# Altium schematic sheet CM4_Conn.SchDoc
size C; SheetNumber: 1; SheetTotal: 4
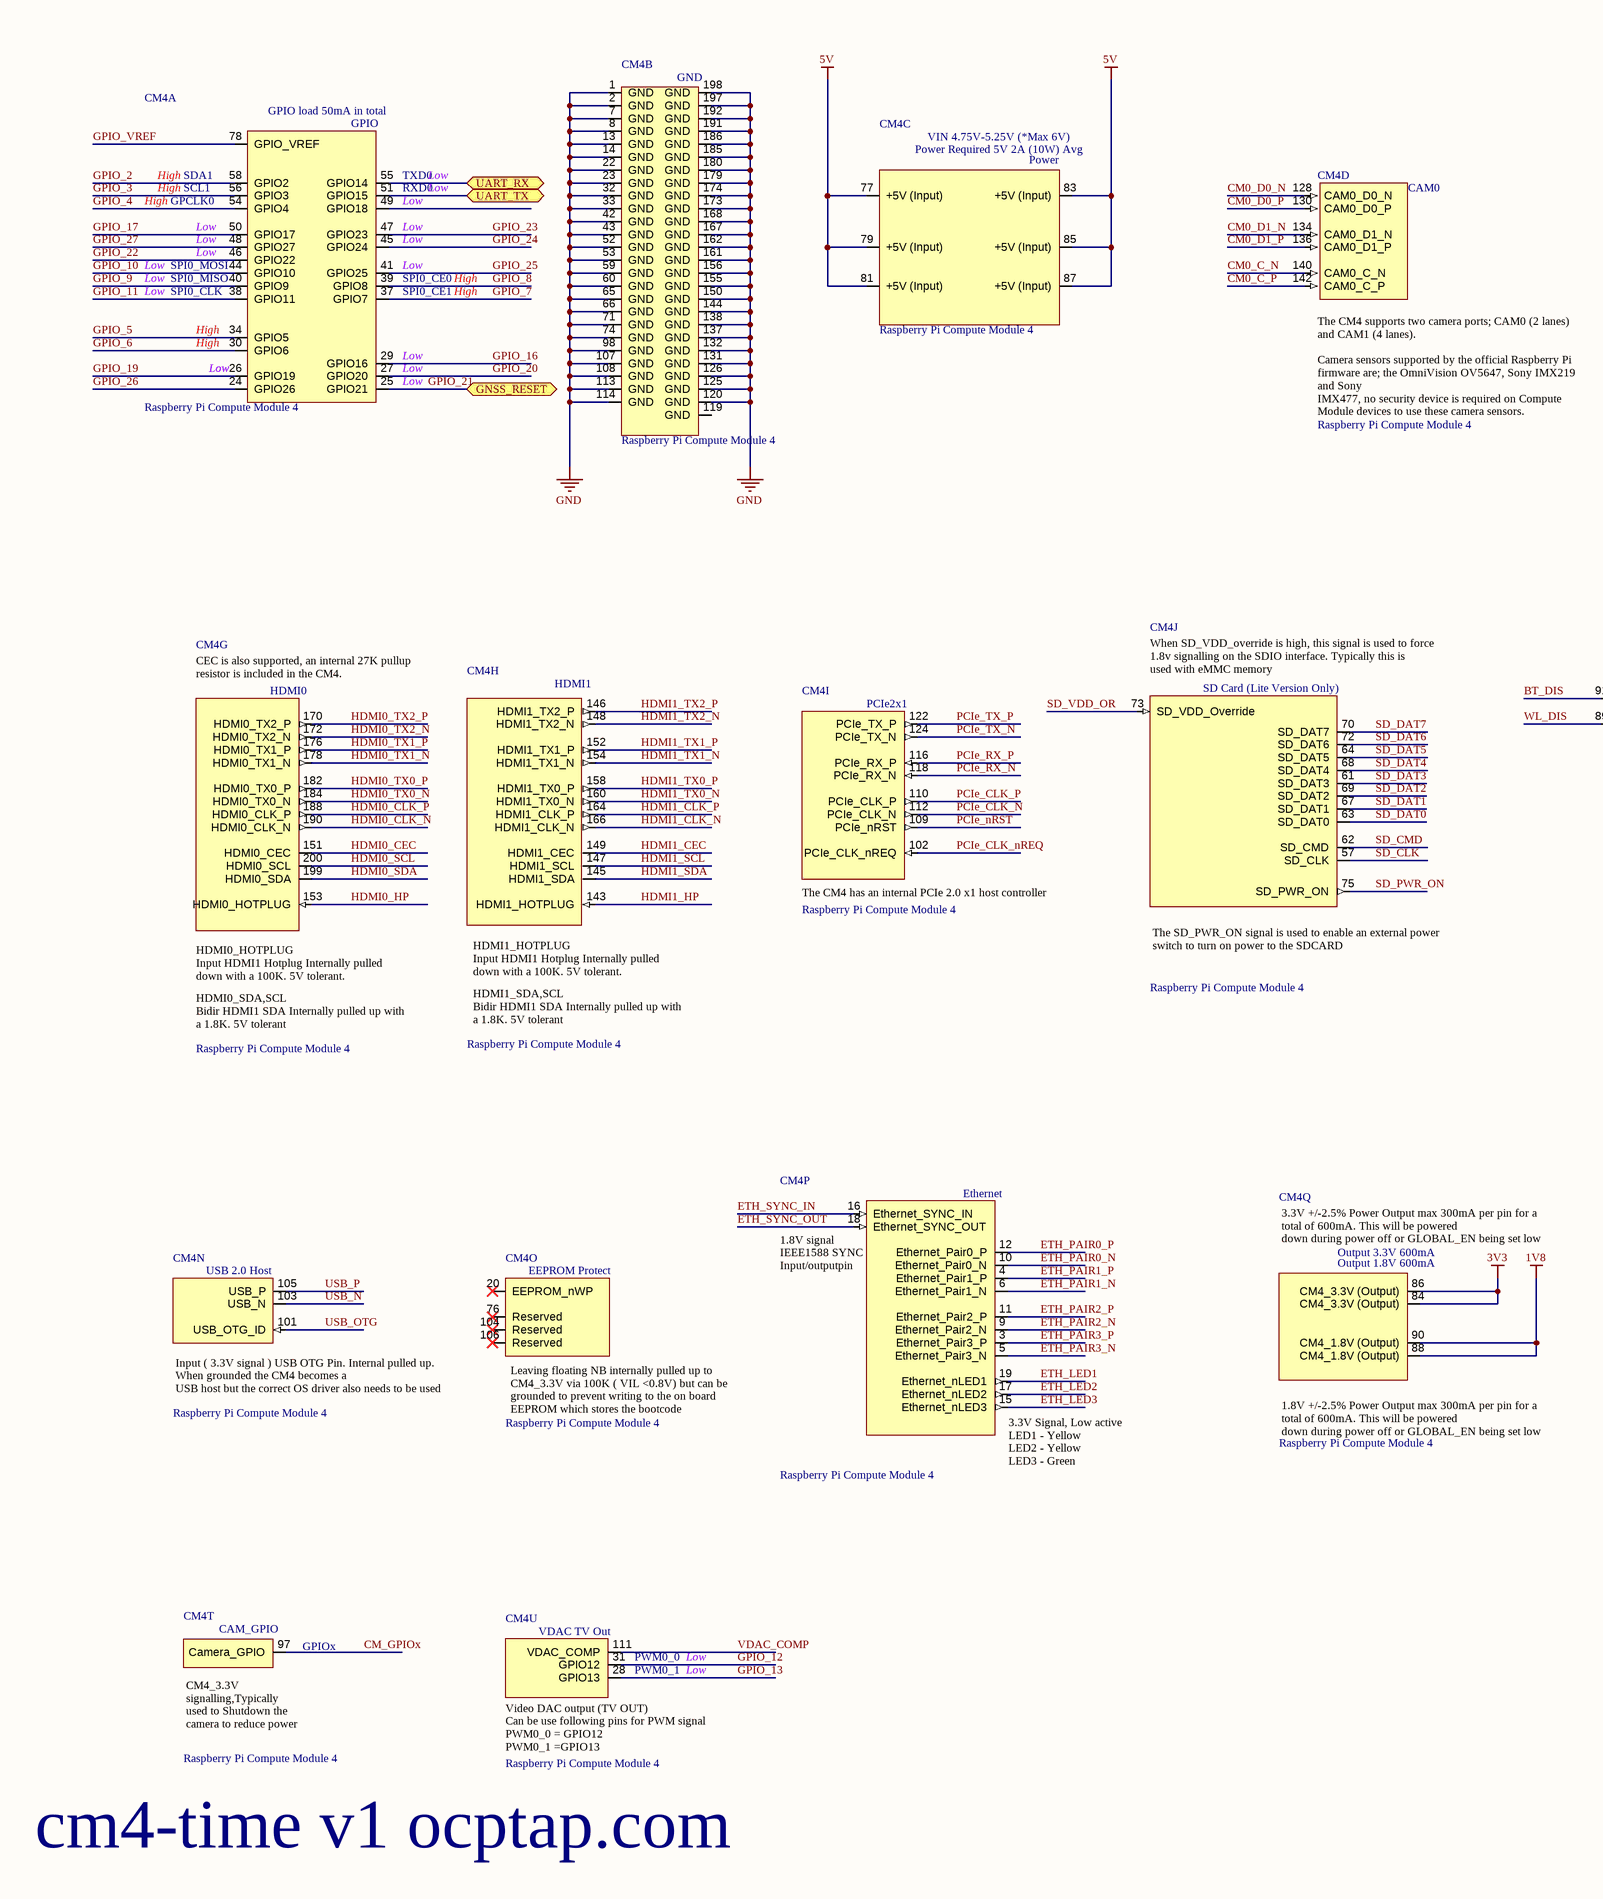
[diagram p0: CM4_Conn.SchDoc, left]
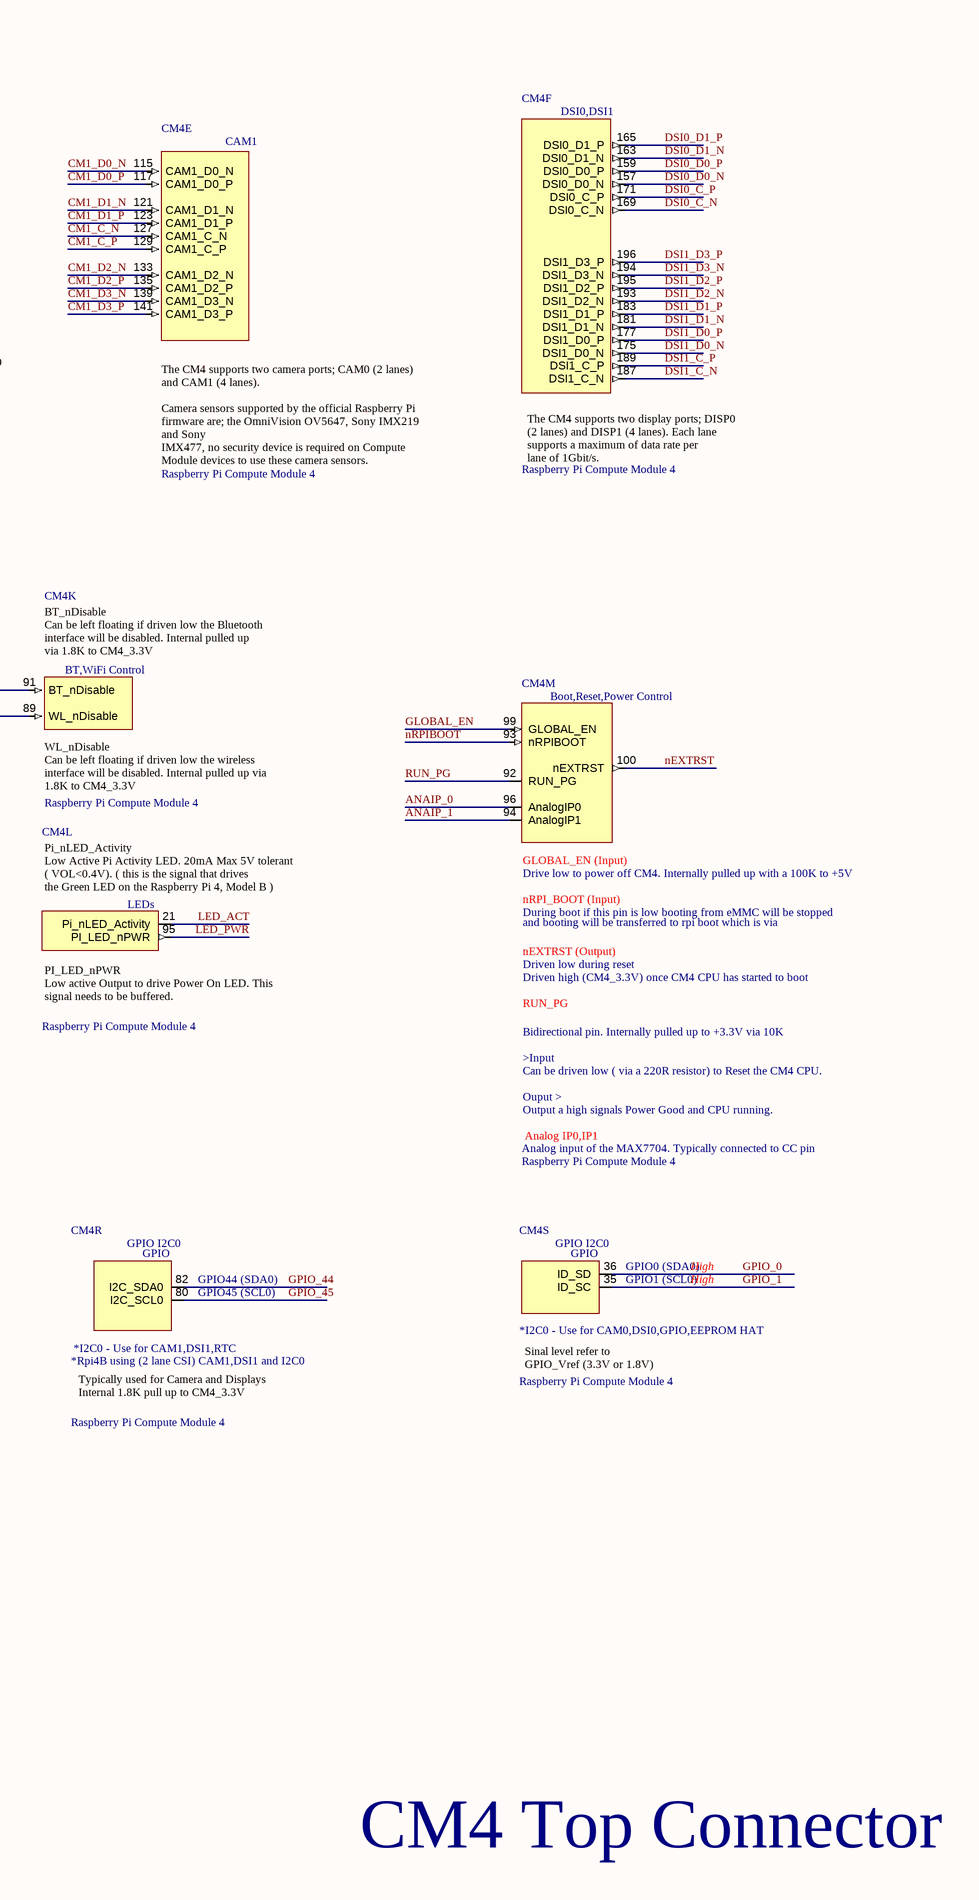
[diagram p1: CM4_Conn.SchDoc, right]

## Parts
CM4  Raspberry Pi Compute Module 4  [CM4-F40C-100DS-0.4v_1.5mm_0mm]  (parts A,B,C,D,E,F,G,H,I,J,K,L,M,N,O,P,Q,R,S,T,U of 21)  (no BOM)

## Ports
GNSS_RESET (bidir), UART_RX (bidir), UART_TX (bidir)

## Nets
1V8: CM4.88(CM4_1.8V_(Output)) CM4.90(CM4_1.8V_(Output))
3V3: CM4.84(CM4_3.3V_(Output)) CM4.86(CM4_3.3V_(Output))
5V: CM4.77(+5V_(Input)) CM4.79(+5V_(Input)) CM4.81(+5V_(Input)) CM4.83(+5V_(Input)) CM4.85(+5V_(Input)) CM4.87(+5V_(Input))
GND: CM4.1(GND) CM4.2(GND) CM4.7(GND) CM4.8(GND) CM4.13(GND) CM4.14(GND) CM4.22(GND) CM4.23(GND) CM4.32(GND) CM4.33(GND) CM4.42(GND) CM4.43(GND) CM4.52(GND) CM4.53(GND) CM4.59(GND) CM4.60(GND) CM4.65(GND) CM4.66(GND) CM4.71(GND) CM4.74(GND) CM4.98(GND) CM4.107(GND) CM4.108(GND) CM4.113(GND) CM4.114(GND) CM4.120(GND) CM4.125(GND) CM4.126(GND) CM4.131(GND) CM4.132(GND) CM4.137(GND) CM4.138(GND) CM4.144(GND) CM4.150(GND) CM4.155(GND) CM4.156(GND) CM4.161(GND) CM4.162(GND) CM4.167(GND) CM4.168(GND) CM4.173(GND) CM4.174(GND) CM4.179(GND) CM4.180(GND) CM4.185(GND) CM4.186(GND) CM4.191(GND) CM4.192(GND) CM4.197(GND) CM4.198(GND)
ANAIP_0: CM4.96(AnalogIP0)
ANAIP_1: CM4.94(AnalogIP1)
BT_DIS: CM4.91(BT_nDisable)
CM0_C_N: CM4.140(CAM0_C_N)
CM0_C_P: CM4.142(CAM0_C_P)
CM0_D0_N: CM4.128(CAM0_D0_N)
CM0_D0_P: CM4.130(CAM0_D0_P)
CM0_D1_N: CM4.134(CAM0_D1_N)
CM0_D1_P: CM4.136(CAM0_D1_P)
CM1_C_N: CM4.127(CAM1_C_N)
CM1_C_P: CM4.129(CAM1_C_P)
CM1_D0_N: CM4.115(CAM1_D0_N)
CM1_D0_P: CM4.117(CAM1_D0_P)
CM1_D1_N: CM4.121(CAM1_D1_N)
CM1_D1_P: CM4.123(CAM1_D1_P)
CM1_D2_N: CM4.133(CAM1_D2_N)
CM1_D2_P: CM4.135(CAM1_D2_P)
CM1_D3_N: CM4.139(CAM1_D3_N)
CM1_D3_P: CM4.141(CAM1_D3_P)
CM_GPIOx: CM4.97(Camera_GPIO)
DSI0_C_N: CM4.169(DSI0_C_N)
DSI0_C_P: CM4.171(DSI0_C_P)
DSI0_D0_N: CM4.157(DSI0_D0_N)
DSI0_D0_P: CM4.159(DSI0_D0_P)
DSI0_D1_N: CM4.163(DSI0_D1_N)
DSI0_D1_P: CM4.165(DSI0_D1_P)
DSI1_C_N: CM4.187(DSI1_C_N)
DSI1_C_P: CM4.189(DSI1_C_P)
DSI1_D0_N: CM4.175(DSI1_D0_N)
DSI1_D0_P: CM4.177(DSI1_D0_P)
DSI1_D1_N: CM4.181(DSI1_D1_N)
DSI1_D1_P: CM4.183(DSI1_D1_P)
DSI1_D2_N: CM4.193(DSI1_D2_N)
DSI1_D2_P: CM4.195(DSI1_D2_P)
DSI1_D3_N: CM4.194(DSI1_D3_N)
DSI1_D3_P: CM4.196(DSI1_D3_P)
ETH_LED1: CM4.19(Ethernet_nLED1)
ETH_LED2: CM4.17(Ethernet_nLED2)
ETH_LED3: CM4.15(Ethernet_nLED3)
ETH_PAIR0_N: CM4.10(Ethernet_Pair0_N)
ETH_PAIR0_P: CM4.12(Ethernet_Pair0_P)
ETH_PAIR1_N: CM4.6(Ethernet_Pair1_N)
ETH_PAIR1_P: CM4.4(Ethernet_Pair1_P)
ETH_PAIR2_N: CM4.9(Ethernet_Pair2_N)
ETH_PAIR2_P: CM4.11(Ethernet_Pair2_P)
ETH_PAIR3_N: CM4.5(Ethernet_Pair3_N)
ETH_PAIR3_P: CM4.3(Ethernet_Pair3_P)
ETH_SYNC_IN: CM4.16(Ethernet_SYNC_IN)
ETH_SYNC_OUT: CM4.18(Ethernet_SYNC_OUT)
GLOBAL_EN: CM4.99(GLOBAL_EN)
GPIO_0: CM4.36(ID_SD)
GPIO_1: CM4.35(ID_SC)
GPIO_2: CM4.58(GPIO2)
GPIO_3: CM4.56(GPIO3)
GPIO_4: CM4.54(GPIO4)
GPIO_5: CM4.34(GPIO5)
GPIO_6: CM4.30(GPIO6)
GPIO_7: CM4.37(GPIO7)
GPIO_8: CM4.39(GPIO8)
GPIO_9: CM4.40(GPIO9)
GPIO_10: CM4.44(GPIO10)
GPIO_11: CM4.38(GPIO11)
GPIO_12: CM4.31(GPIO12)
GPIO_13: CM4.28(GPIO13)
GPIO_16: CM4.29(GPIO16)
GPIO_17: CM4.50(GPIO17)
GPIO_19: CM4.26(GPIO19)
GPIO_20: CM4.27(GPIO20)
GPIO_21: CM4.25(GPIO21) ; port GNSS_RESET
GPIO_22: CM4.46(GPIO22)
GPIO_23: CM4.47(GPIO23)
GPIO_24: CM4.45(GPIO24)
GPIO_25: CM4.41(GPIO25)
GPIO_26: CM4.24(GPIO26)
GPIO_27: CM4.48(GPIO27)
GPIO_44: CM4.82(I2C_SDA0)
GPIO_45: CM4.80(I2C_SCL0)
GPIO_VREF: CM4.78(GPIO_VREF)
HDMI0_CEC: CM4.151(HDMI0_CEC)
HDMI0_CLK_N: CM4.190(HDMI0_CLK_N)
HDMI0_CLK_P: CM4.188(HDMI0_CLK_P)
HDMI0_HP: CM4.153(HDMI0_HOTPLUG)
HDMI0_SCL: CM4.200(HDMI0_SCL)
HDMI0_SDA: CM4.199(HDMI0_SDA)
HDMI0_TX0_N: CM4.184(HDMI0_TX0_N)
HDMI0_TX0_P: CM4.182(HDMI0_TX0_P)
HDMI0_TX1_N: CM4.178(HDMI0_TX1_N)
HDMI0_TX1_P: CM4.176(HDMI0_TX1_P)
HDMI0_TX2_N: CM4.172(HDMI0_TX2_N)
HDMI0_TX2_P: CM4.170(HDMI0_TX2_P)
HDMI1_CEC: CM4.149(HDMI1_CEC)
HDMI1_CLK_N: CM4.166(HDMI1_CLK_N)
HDMI1_CLK_P: CM4.164(HDMI1_CLK_P)
HDMI1_HP: CM4.143(HDMI1_HOTPLUG)
HDMI1_SCL: CM4.147(HDMI1_SCL)
HDMI1_SDA: CM4.145(HDMI1_SDA)
HDMI1_TX0_N: CM4.160(HDMI1_TX0_N)
HDMI1_TX0_P: CM4.158(HDMI1_TX0_P)
HDMI1_TX1_N: CM4.154(HDMI1_TX1_N)
HDMI1_TX1_P: CM4.152(HDMI1_TX1_P)
HDMI1_TX2_N: CM4.148(HDMI1_TX2_N)
HDMI1_TX2_P: CM4.146(HDMI1_TX2_P)
LED_ACT: CM4.21(Pi_nLED_Activity)
LED_PWR: CM4.95(PI_LED_nPWR)
nEXTRST: CM4.100(nEXTRST)
nRPIBOOT: CM4.93(nRPIBOOT)
PCIe_CLK_N: CM4.112(PCIe_CLK_N)
PCIe_CLK_nREQ: CM4.102(PCIe_CLK_nREQ)
PCIe_CLK_P: CM4.110(PCIe_CLK_P)
PCIe_nRST: CM4.109(PCIe_nRST)
PCIe_RX_N: CM4.118(PCIe_RX_N)
PCIe_RX_P: CM4.116(PCIe_RX_P)
PCIe_TX_N: CM4.124(PCIe_TX_N)
PCIe_TX_P: CM4.122(PCIe_TX_P)
RUN_PG: CM4.92(RUN_PG)
SD_CLK: CM4.57(SD_CLK)
SD_CMD: CM4.62(SD_CMD)
SD_DAT0: CM4.63(SD_DAT0)
SD_DAT1: CM4.67(SD_DAT1)
SD_DAT2: CM4.69(SD_DAT2)
SD_DAT3: CM4.61(SD_DAT3)
SD_DAT4: CM4.68(SD_DAT4)
SD_DAT5: CM4.64(SD_DAT5)
SD_DAT6: CM4.72(SD_DAT6)
SD_DAT7: CM4.70(SD_DAT7)
SD_PWR_ON: CM4.75(SD_PWR_ON)
SD_VDD_OR: CM4.73(SD_VDD_Override)
UART_RX: CM4.55(GPIO14) ; port UART_RX
UART_TX: CM4.51(GPIO15) ; port UART_TX
USB_N: CM4.103(USB_N)
USB_OTG: CM4.101(USB_OTG_ID)
USB_P: CM4.105(USB_P)
VDAC_COMP: CM4.111(VDAC_COMP)
WL_DIS: CM4.89(WL_nDisable)

Not connected (* = marked no-connect by the designer): CM4 20(EEPROM_nWP)* 49(GPIO18) 76(Reserved)* 104(Reserved)* 106(Reserved)* 119(GND)

## Notes on the sheet
- cm4-time v1 ocptap.com
- CM4 Top Connector
- DWG. NO.
- REV.
- SHT.
- REVISION
- DESCRIPTION
- DATE
- APPROVED
- THIS DOCUMENT AND THE DATA DISCLOSED HEREIN OR HEREWITH IS THE PROPERTY OF ALTIUM LIMITED AND MAY BE FREELY DISTRIBUTED IN WHOLE. NO RIGHTS ARE RESERVED OR EXPRESS OR IMPLIED WARANTEE GIVEN.
- ENG:
- DSN:
- APPROVALS
- PROJECT
- DOCUMENT REVISION:
- DESIGN ITEM:
- CHK:
- BOM:
- REFERENCE DOCUMENTS
- PROJECT REVISION:
- TITLE
- FAB DWG:
- PCB DWG:
- ASSY DWG:
- SCALE:
- SIZE
- C
- CAGE CODE
- FILE NAME
- DWG NO.
- SHEET
- OF
- REV
- (in symbol CM4, part A) GPIO load 50mA in total; GPIO; High; SDA1; TXD0; Low; SCL1; RXD0; GPCLK0; SPI0_MOSI; SPI0_MISO; SPI0_CE0; SPI0_CLK; SPI0_CE1; by Amornthep Phunsin
- (in symbol CM4, part C) VIN 4.75V-5.25V (*Max 6V); Power Required 5V 2A (10W) Avg; Power; by Amornthep Phunsin
- (in symbol CM4, part D) CAM0; The CM4 supports two camera ports; CAM0 (2 lanes) and CAM1 (4 lanes). / Camera sensors supported by the official Raspberry Pi firmware are; the OmniVision OV5647, Sony IMX219 and Sony / IMX477, no security device is required on Compute Module devices to use these camera sensors.
- (in symbol CM4, part E) CAM1; The CM4 supports two camera ports; CAM0 (2 lanes) and CAM1 (4 lanes). / Camera sensors supported by the official Raspberry Pi firmware are; the OmniVision OV5647, Sony IMX219 and Sony / IMX477, no security device is required on Compute Module devices to use these camera sensors.
- (in symbol CM4, part F) DSI0,DSI1; The CM4 supports two display ports; DISP0 (2 lanes) and DISP1 (4 lanes). Each lane supports a maximum of data rate per / lane of 1Gbit/s.
- (in symbol CM4, part G) HDMI0; CEC is also supported, an internal 27K pullup resistor is included in the CM4.; HDMI0_HOTPLUG / Input HDMI1 Hotplug Internally pulled down with a 100K. 5V tolerant.; HDMI0_SDA,SCL / Bidir HDMI1 SDA Internally pulled up with a 1.8K. 5V tolerant
- (in symbol CM4, part H) HDMI1; HDMI1_HOTPLUG / Input HDMI1 Hotplug Internally pulled down with a 100K. 5V tolerant.; HDMI1_SDA,SCL / Bidir HDMI1 SDA Internally pulled up with a 1.8K. 5V tolerant
- (in symbol CM4, part I) PCIe2x1; The CM4 has an internal PCIe 2.0 x1 host controller
- (in symbol CM4, part J) When SD_VDD_override is high, this signal is used to force 1.8v signalling on the SDIO interface. Typically this is / used with eMMC memory; SD Card (Lite Version Only); by Amornthep Phunsin; The SD_PWR_ON signal is used to enable an external power switch to turn on power to the SDCARD
- (in symbol CM4, part K) BT_nDisable / Can be left floating if driven low the Bluetooth interface will be disabled. Internal pulled up / via 1.8K to CM4_3.3V; BT,WiFi Control; WL_nDisable / Can be left floating if driven low the wireless interface will be disabled. Internal pulled up via / 1.8K to CM4_3.3V
- (in symbol CM4, part L) Pi_nLED_Activity / Low Active Pi Activity LED. 20mA Max 5V tolerant ( VOL<0.4V). ( this is the signal that drives / the Green LED on the Raspberry Pi 4, Model B ); LEDs; PI_LED_nPWR / Low active Output to drive Power On LED. This signal needs to be buffered.
- (in symbol CM4, part M) Boot,Reset,Power Control; GLOBAL_EN (Input); Drive low to power off CM4. Internally pulled up with a 100K to +5V; nRPI_BOOT (Input); During boot if this pin is low booting from eMMC will be stopped; and booting will be transferred to rpi boot which is via; nEXTRST (Output); Driven low during reset; Driven high (CM4_3.3V) once CM4 CPU has started to boot; Bidirectional pin. Internally pulled up to +3.3V via 10K / >Input / Can be driven low ( via a 220R resistor) to Reset the CM4 CPU. / Ouput > / Output a high signals Power Good and CPU running.; Analog IP0,IP1; Analog input of the MAX7704. Typically connected to CC pin
- (in symbol CM4, part N) USB 2.0 Host; Input ( 3.3V signal ) USB OTG Pin. Internal pulled up. When grounded the CM4 becomes a / USB host but the correct OS driver also needs to be used
- (in symbol CM4, part O) EEPROM Protect; Leaving floating NB internally pulled up to CM4_3.3V via 100K ( VIL <0.8V) but can be / grounded to prevent writing to the on board EEPROM which stores the bootcode
- (in symbol CM4, part P) Ethernet; 1.8V signal / IEEE1588 SYNC Input/outputpin; by Amornthep Phunsin; 3.3V Signal, Low active / LED1 - Yellow / LED2 - Yellow / LED3 - Green
- (in symbol CM4, part Q) 3.3V +/-2.5% Power Output max 300mA per pin for a total of 600mA. This will be powered / down during power off or GLOBAL_EN being set low; Output 3.3V 600mA; Output 1.8V 600mA; 1.8V +/-2.5% Power Output max 300mA per pin for a total of 600mA. This will be powered / down during power off or GLOBAL_EN being set low
- (in symbol CM4, part R) GPIO I2C0; GPIO; GPIO44 (SDA0); GPIO45 (SCL0); *I2C0 - Use for CAM1,DSI1,RTC; *Rpi4B using (2 lane CSI) CAM1,DSI1 and I2C0; Typically used for Camera and Displays Internal 1.8K pull up to CM4_3.3V
- (in symbol CM4, part S) GPIO I2C0; GPIO; GPIO0 (SDA0); High; GPIO1 (SCL0); *I2C0 - Use for CAM0,DSI0,GPIO,EEPROM HAT; Sinal level refer to  GPIO_Vref (3.3V or 1.8V)
- (in symbol CM4, part T) CAM_GPIO; GPIOx; CM4_3.3V signalling,Typically used to Shutdown the camera to reduce power
- (in symbol CM4, part U) VDAC TV Out; PWM0_0; Low; PWM0_1; Video DAC output (TV OUT) / Can be use following pins for PWM signal / PWM0_0 = GPIO12 / PWM0_1 =GPIO13

## Library data of the parts
CM4 = CM4: Raspberry Pi Compute Module 4 by Amornthep Phunsin